# EAGLE schematic servo_1 (EAGLE 6.5.0)
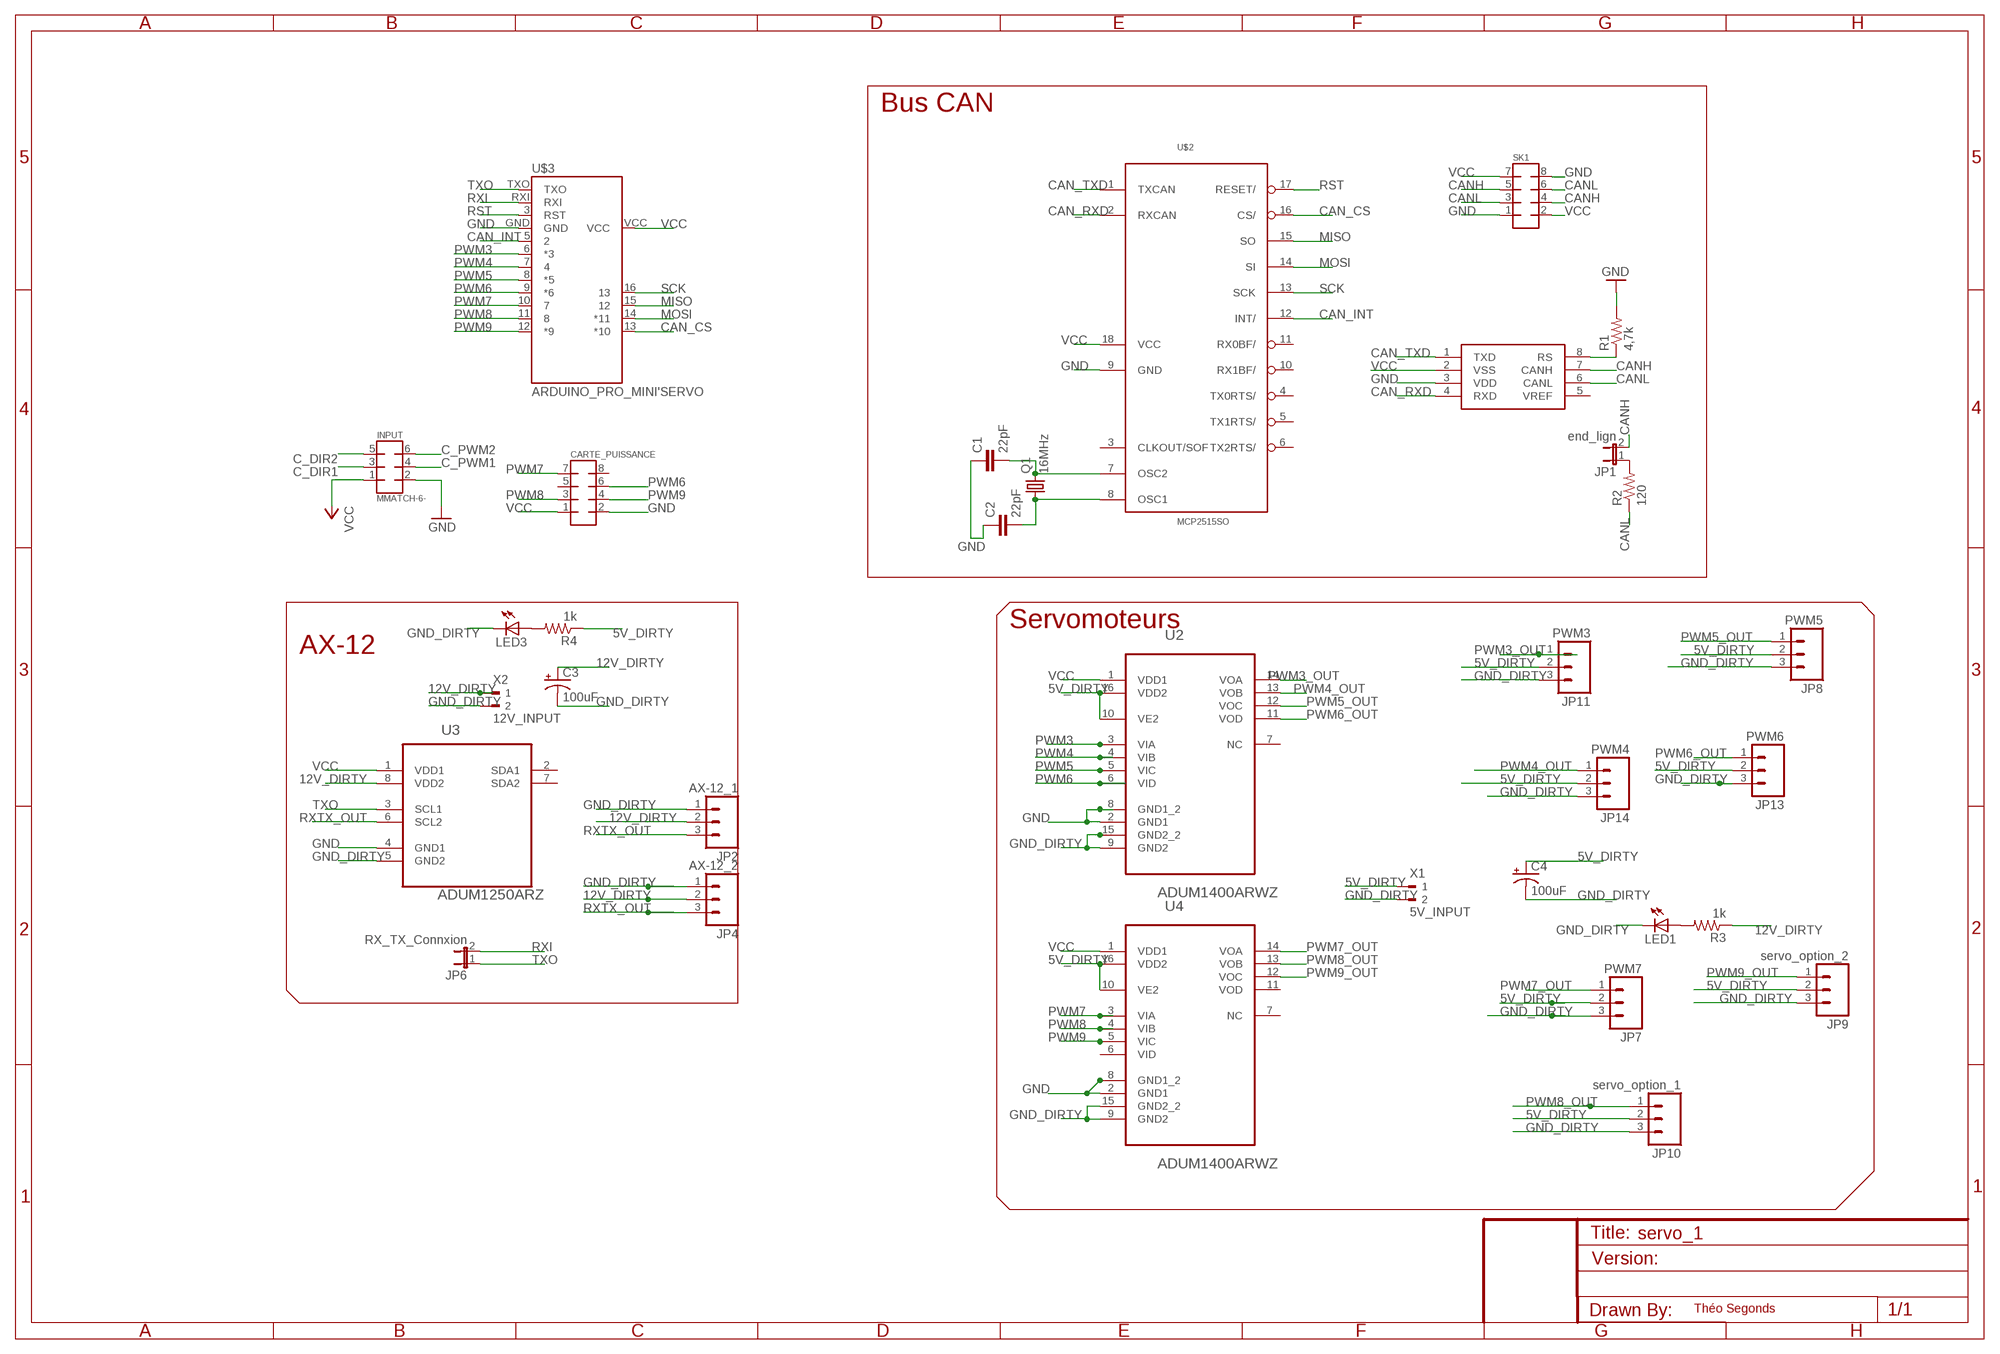
[diagram p0: schematic, sheet 1]

## Parts
C1  22pF  CAP0805  [0805]
C2  22pF  CAP0805  [0805]
C3  100uF  CAP_POLPTH1  [CPOL-RADIAL-100UF-25V]
C4  100uF  CAP_POLPTH1  [CPOL-RADIAL-100UF-25V]
CARTE_PUISSANCE  MMATCH-8-PTH  [AMP-215079-8]
INPUT  MMATCH-6-  [AMP-215079-6]
JP1  end_lign  JUMPER-2PTH  [1X02]
JP2  AX-12_1  M03POLAR  [MOLEX-1X3]
JP4  AX-12_2  M03POLAR  [MOLEX-1X3]
JP6  RX_TX_Connxion  JUMPER-2PTH  [1X02]
JP7  PWM7  M03PTH  [1X03]
JP8  PWM5  M03PTH  [1X03]
JP9  servo_option_2  M03PTH  [1X03]
JP10  servo_option_1  M03PTH  [1X03]
JP11  PWM3  M03PTH  [1X03]
JP13  PWM6  M03PTH  [1X03]
JP14  PWM4  M03PTH  [1X03]
LED1  LEDCHIPLED_0805  [CHIPLED_0805]
LED3  LEDCHIPLED_0805  [CHIPLED_0805]
Q1  16MHz  CRYSTALHC49S  [HC49/S]
R1  4,7k  RESISTOR0805-RES  [0805]
R2  120  RESISTOR0805-RES  [0805]
R3  1k  RESISTOR0805-RES  [0805]
R4  1k  RESISTOR0805-RES  [0805]
SK1  MMATCH-8-PTH  [AMP-215079-8]
U1  MCP2551  [SO08]
U2  ADUM1400ARWZ  [SOIC127P1032X265-16N]
U3  ADUM1250ARZ  [SOIC127P600X175-8N]
U4  ADUM1400ARWZ  [SOIC127P1032X265-16N]
U$2  MCP2515SO  [SO18L]
U$3  ARDUINO_PRO_MINI'SERVO  [ARDUINO_PRO_MINI]
X1  5V_INPUT  90-2  [90-2]
X2  12V_INPUT  90-2  [90-2]

## Nets
5V_DIRTY: C4.1(+) JP7.2 JP8.2 JP9.2 JP10.2 JP11.2 JP13.2 JP14.2 R4.1 U2.10(VE2) U2.16(VDD2) U4.10(VE2) U4.16(VDD2) X1.1
12V_DIRTY: C3.1(+) JP2.2 JP4.2 R3.1 U3.8(VDD2) X2.1
C_DIR1: INPUT.3
C_DIR2: INPUT.5
C_PWM1: INPUT.4
C_PWM2: INPUT.6
CAN_CS: U$2.16(CS/) U$3.13(*10)
CAN_INT: U$2.12(INT/) U$3.5
CAN_RXD: U1.4(RXD) U$2.2(RXCAN)
CAN_TXD: U1.1(TXD) U$2.1(TXCAN)
CANH: JP1.2 SK1.4 SK1.5 U1.7(CANH)
CANL: R2.1 SK1.3 SK1.6 U1.6(CANL)
GND: C1.1 C2.1 CARTE_PUISSANCE.2 INPUT.2 R1.2 SK1.1 SK1.8 U1.3(VDD) U2.2(GND1) U2.8(GND1_2) U3.4(GND1) U4.2(GND1) U4.8(GND1_2) U$2.9(GND) U$3.GND
GND_DIRTY: C3.2(-) C4.2(-) JP2.1 JP4.1 JP7.3 JP8.3 JP9.3 JP10.3 JP11.3 JP13.3 JP14.3 LED1.C LED3.C U2.9(GND2) U2.15(GND2_2) U3.5(GND2) U4.9(GND2) U4.15(GND2_2) X1.2 X2.2
MISO: U$2.15(SO) U$3.15
MOSI: U$2.14(SI) U$3.14(*11)
N$2: C1.2 Q1.2 U$2.7(OSC2)
N$3: C2.2 Q1.1 U$2.8(OSC1)
N$4: LED1.A R3.2
N$5: R1.1 U1.8(RS)
N$6: LED3.A R4.2
N$7: JP1.1 R2.2
PWM3: U2.3(VIA) U$3.6(*3)
PWM3_OUT: JP11.1 U2.14(VOA)
PWM4: U2.4(VIB) U$3.7
PWM4_OUT: JP14.1 U2.13(VOB)
PWM5: U2.5(VIC) U$3.8(*5)
PWM5_OUT: JP8.1 U2.12(VOC)
PWM6: CARTE_PUISSANCE.6 U2.6(VID) U$3.9(*6)
PWM6_OUT: JP13.1 U2.11(VOD)
PWM7: CARTE_PUISSANCE.7 U4.3(VIA) U$3.10
PWM7_OUT: JP7.1 U4.14(VOA)
PWM8: CARTE_PUISSANCE.3 U4.4(VIB) U$3.11
PWM8_OUT: JP10.1 U4.13(VOB)
PWM9: CARTE_PUISSANCE.4 U4.5(VIC) U$3.12(*9)
PWM9_OUT: JP9.1 U4.12(VOC)
RST: U$2.17(RESET/) U$3.3(RST)
RXI: JP6.2 U$3.RXI
RXTX_OUT: JP2.3 JP4.3 U3.6(SCL2)
SCK: U$2.13(SCK) U$3.16
TXO: JP6.1 U3.3(SCL1) U$3.TXO
VCC: CARTE_PUISSANCE.1 INPUT.1 SK1.2 SK1.7 U1.2(VSS) U2.1(VDD1) U3.1(VDD1) U4.1(VDD1) U$2.18(VCC) U$3.VCC
Unconnected: CARTE_PUISSANCE.5 CARTE_PUISSANCE.8 U1.5(VREF) U2.7(NC) U3.2(SDA1) U3.7(SDA2) U4.6(VID) U4.7(NC) U4.11(VOD) U$2.3(CLKOUT/SOF) U$2.4(TX0RTS/) U$2.5(TX1RTS/) U$2.6(TX2RTS/) U$2.10(RX1BF/) U$2.11(RX0BF/)

## Notes on the sheet
- Bus CAN
- Servomoteurs
- AX-12
- Théo Segonds

## Library data of the parts
C1 C2 = SparkFun-Capacitors:CAP: Capacitor Standard 0603 ceramic capacitor, and 0.1" leaded capacitor.; MF: AVX; MPN: 08055A220JAT2A; OC_FARNELL: 2280675RL
C3 C4 = SparkFun-Capacitors:CAP_POL: Capacitor Polarized These are standard SMD and PTH capacitors. Normally 10uF, 47uF, and 100uF in electrolytic and tantalum varieties. Always verify the external diameter of the through hole cap, it varies with capacity, voltage, and manufacturer. The EIA devices should be standard.; MF: RUBYCON; MPN: 100TXW100MEFC8X30; OC_FARNELL: 2346289
CARTE_PUISSANCE SK1 = jt-con-micromatch:MMATCH-8-*: AMP Micromatch 8-pin; OC_FARNELL: unknown
INPUT = jt-con-micromatch:MMATCH-6-*
JP1 JP6 = SparkFun-Passives:JUMPER-2: Jumper Basic 0.1" spaced jumper. Use with breakaway headers.; OC_FARNELL: unknown
JP2 JP4 JP7-JP11 JP13 JP14 = SparkFun-Connectors:M03: Header 3 Standard 3-pin 0.1" header. Use with straight break away headers (SKU : PRT-00116), right angle break away headers (PRT-00553), swiss pins (PRT-00743), machine pins (PRT-00117), and female headers (PRT-00115). Molex polarized connector foot print use with SKU : PRT-08232 with associated crimp pins and housings.; OC_FARNELL: unknown
LED1 LED3 = adafruit:LED: LED OSRAM: - CHIPLED LG R971, LG N971, LY N971, LG Q971, LY Q971, LO R971, LY R971 LH N974, LH R974 LS Q976, LO Q976, LY Q976 LO Q996 - Hyper CHIPLED LW Q18S LB Q993, LB Q99A, LB R99A - SideLED LS A670, LO A670, LY A670, LG A670, LP A670 LB A673, LV A673, LT A673, LW A673 LH A674 LY A675 LS A676, LA A676, LO A676, LY A676, LW A676 LS A679, LY A679, LG A679 - Hyper Micro SIDELED® LS Y876, LA Y876, LO Y876, LY Y876 LT Y87S - SmartLED LW L88C, LW L88S LB L89C, LB L89S, LG L890 LS L89K, LO L89K, LY L89K LS L896, LA L896, LO L896, LY L896 - TOPLED LS T670, LO T670, LY T670, LG T670, LP T670 LSG T670, LSP T670, LSY T670, LOP T670, LYG T670 LG T671, LOG T671, LSG T671 LB T673, LV T673, LT T673, LW T673 LH T674 LS T676, LA T676, LO T676, LY T676, LB T676, LH T676, LSB T676, LW T676 LB T67C, LV T67C, LT T67C, LS T67K, LO T67K, LY T67K, LW E67C LS E67B, LA E67B, LO E67B, LY E67B, LB E67C, LV E67C, LT E67C LW T67C LS T679, LY T679, LG T679 LS T770, LO T770, LY T770, LG T770, LP T770 LB T773, LV T773, LT T773, LW T773 LH T774 LS E675, LA E675, LY E675, LS T675 LS T776, LA T776, LO T776, LY T776, LB T776 LHGB T686 LT T68C, LB T68C - Hyper Mini TOPLED® LB M676 - Mini TOPLED Santana® LG M470 LS M47K, LO M47K, LY M47K Source: http://www.osram.convergy.de/
Q1 = adafruit:CRYSTAL: CRYSTAL; MF: MULTICOMP; MPN: HC49SM-3.6864-30-50-60-16-ATF; OC_FARNELL: 1667008; OC_NEWARK: unknown
R1-R4 = SparkFun-Passives:RESISTOR: Resistor Basic schematic elements and footprints for 0603, 1206, and PTH resistors.; OC_FARNELL: unknown
U1 = SparkFun-DigitalIC:MCP2551: CAN transceiver; MF: MICROCHIP; MPN: MCP2551-I/SN...; OC_FARNELL: 2119745
U2 U4 = Analog Devices_By_element14_Batch_1:ADUM1400ARWZ: Quad-Channel Digital Isolators; MF: ANALOG DEVICES; MPN: ADUM1400ARWZ; OC_FARNELL: 1226217; OC_NEWARK: 19M8755; PACKAGE: SOIC-16; SUPPLIER: Analog Devices
U3 = Analog Devices_By_element14_Batch_1:ADUM1250ARZ: Hot Swappable, Dual I2C Isolators; MF: ANALOG DEVICES; MPN: ADUM1250ARZ; OC_FARNELL: 1814353; OC_NEWARK: 27M9880; PACKAGE: SOIC-8; SUPPLIER: Analog Devices
U$2 = MCP2515_MT:MCP2515*: MCP2515 Standalone CAN-Controller by Microchip Eagle-Lib. by MartinThomas; OC_FARNELL: unknown
U$3 = can_bus_servo:ARDUINO_PRO_MINI; OC_FARNELL: unknown
X1 X2 = con-weidmueller-sl35:90-2: WEIDMUELLER CLAMP CONNECTOR; OC_FARNELL: unknown; OC_NEWARK: unknown

## Net classes
0 default: clearance 0.205 mm